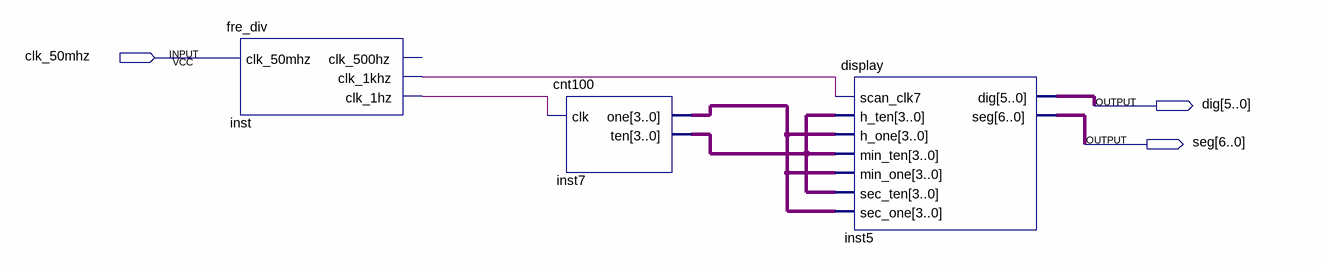
[diagram p0: schematic sheet]
// Quartus schematic 7seg_display_cnt100.bdf as structural Verilog: 3 symbols, 3 pins
module \7seg_display_cnt100  (
  input  clk_50mhz,
  output [5:0] dig,
  output [6:0] seg
);

  wire inst_clk_1hz, inst_clk_1khz;
  wire [3:0] inst7_one, inst7_ten;

  fre_div inst (.clk_50mhz(clk_50mhz), .clk_1khz(inst_clk_1khz), .clk_1hz(inst_clk_1hz));  // open: clk_500hz
  cnt100 inst7 (.clk(inst_clk_1hz), .one(inst7_one), .ten(inst7_ten));
  display inst5 (
    .scan_clk7(inst_clk_1khz), .h_ten(inst7_ten), .h_one(inst7_one), .min_ten(inst7_ten),
    .min_one(inst7_one), .sec_ten(inst7_ten), .sec_one(inst7_one), .dig(dig), .seg(seg));
endmodule
